# Altium schematic sheet DIV30.SchDoc
size A4; SheetNumber: 8; SheetTotal: 15
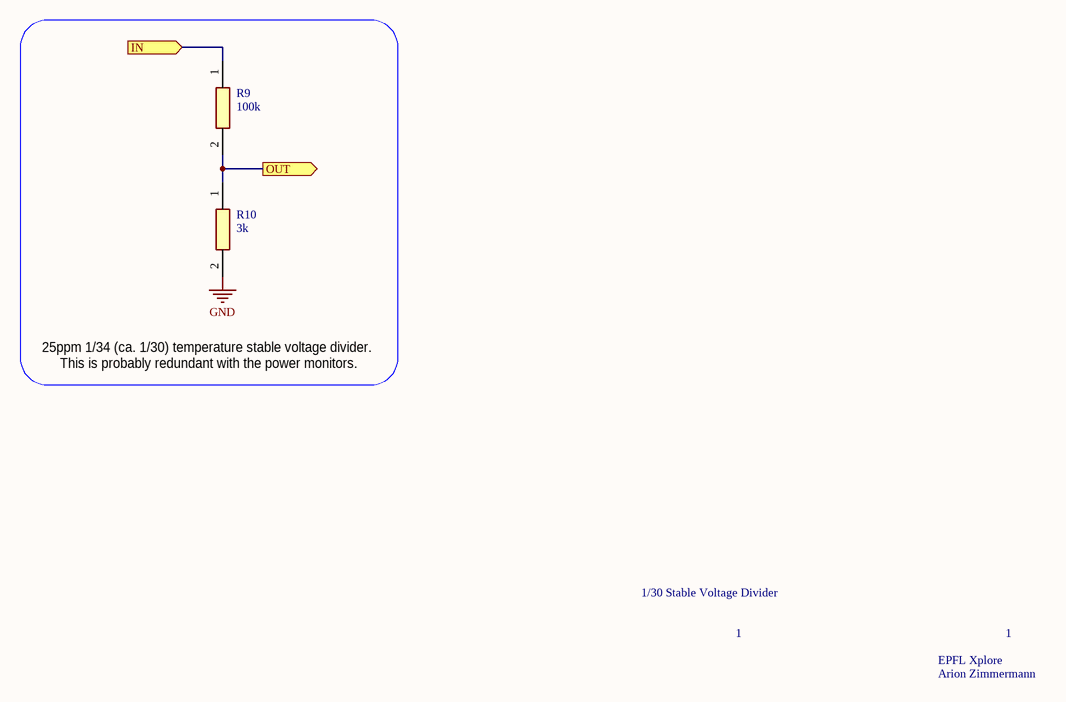
[diagram p0: DIV30.SchDoc]

## Parts
R9  value 100k  [RESC1608X55N]  (hidden comment: TNPW0603100KBEEA)
R10  value 3k  [RESC1608X55N]  (hidden comment: TNPW06033K00BEEA)

## Ports
IN (in), OUT (out)

## Nets
GND: R10.2
IN: R9.1 ; port IN
OUT: R9.2 R10.1 ; port OUT

## Notes on the sheet
- 25ppm 1/34 (ca. 1/30) temperature stable voltage divider.
  This is probably redundant with the power monitors.
- 1/30 Stable Voltage Divider
- 1
- EPFL Xplore
- Arion Zimmermann

## Library data of the parts
R9 = TNPW0603100KBEEA: Resistor; Manufacturer_Name: Vishay; Datasheet Link: https://datasheet.datasheetarchive.com/originals/distributors/DKDS41/DSANUWW0030147.pdf; Height: 0.55mm; Manufacturer_Part_Number: TNPW0603100KBEEA
R10 = TNPW06033K00BEEA: Resistor; Manufacturer_Name: Vishay; Datasheet Link: http://www.vishay.com/docs/28758/tnpw_e3.pdf; Height: 0.55mm; Manufacturer_Part_Number: TNPW06033K00BEEA; Mouser Part Number: 71-TNPW06033K00BEEA; Mouser Price/Stock: https://www.mouser.co.uk/ProductDetail/Vishay-Dale/TNPW06033K00BEEA?qs=kHCK1FE53PnaIDT%252BQ71GHQ%3D%3D